# Altium project LED_Board.PrjPcb
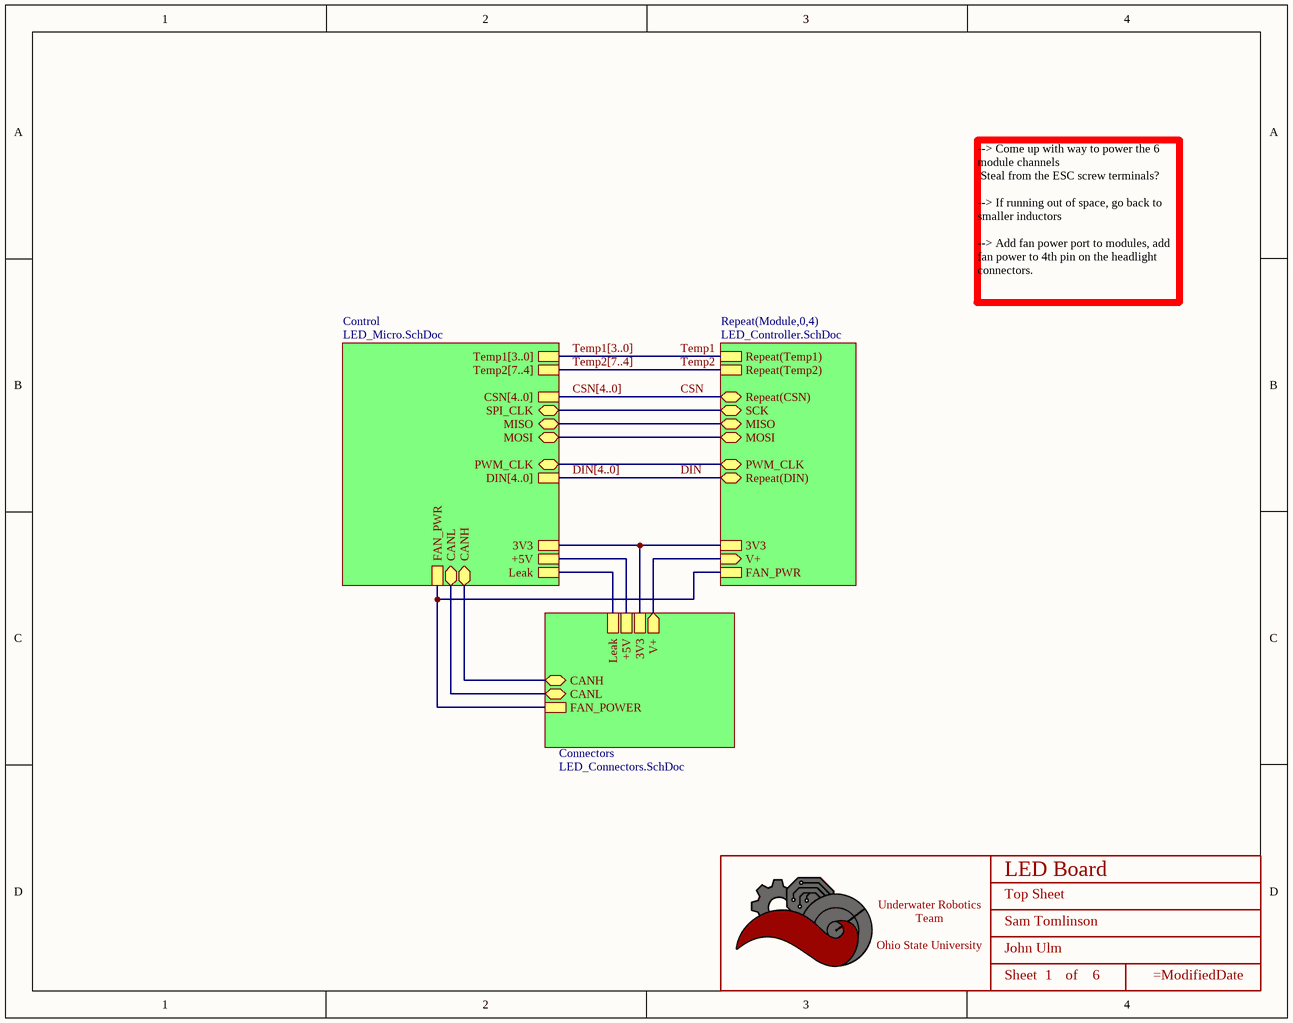
[diagram p0: LED_Board_Top.SchDoc]
BoardRevision: 1.0; DateOfDesignReview: XX/XX/XXXX; ProjectTitle: Sample Template Project; TeamLead: Sample Team Lead
4 sheets, 160 parts. Net scope: hierarchical (ports join the sheet entries above them; power ports are global).
Board file: LED_Control.PcbDoc
Sheets:
  LED_Board_Top.SchDoc
    Connectors = LED_Connectors.SchDoc
    Control = LED_Micro.SchDoc
    Module0 = LED_Controller.SchDoc
    Module1 = LED_Controller.SchDoc
    Module2 = LED_Controller.SchDoc
    Module3 = LED_Controller.SchDoc
    Module4 = LED_Controller.SchDoc

## Sheet LED_Board_Top.SchDoc: Top Sheet
size A; Author: Sam Tomlinson; SheetNumber: 1; SheetTotal: 6; TeamLead: John Ulm; ProjectTitle: LED Board

### Parts
(Parts that share a designator on the sheet are numbered #1, #2 ... from top to bottom, then left to right.)
*#1  Title_Block  [LOGO]  (value not drawn)  (graphical)

### Sub-sheets
Connectors = LED_Connectors.SchDoc: Leak, +5V, 3V3, CANH (bidir), CANL (bidir), FAN_POWER, V+ (out)
Control = LED_Micro.SchDoc: +5V, 3V3, PWM_CLK (bidir), SPI_CLK (bidir), MISO (bidir), MOSI (bidir), CANH (bidir), CANL (bidir), FAN_PWR, DIN[4..0], CSN[4..0], Temp1[3..0], Leak, Temp2[7..4]
Repeat(Module,0,4) = LED_Controller.SchDoc: Repeat(CSN) (bidir), PWM_CLK (bidir), SCK (bidir), MOSI (bidir), MISO (bidir), Repeat(DIN) (bidir), V+ (in), Repeat(Temp1), 3V3, Repeat(Temp2), FAN_PWR

### Nets
_+5V: sheet Connectors/+5V, sheet Control/+5V
_V+: sheet Connectors/V+, sheet Repeat(Module,0,4)/V+
_3V3: sheet Connectors/3V3, sheet Control/3V3, sheet Repeat(Module,0,4)/3V3
_CANH: sheet Connectors/CANH, sheet Control/CANH
_CANL: sheet Connectors/CANL, sheet Control/CANL
_Fan_PWR: sheet Connectors/FAN_POWER, sheet Control/FAN_PWR, sheet Repeat(Module,0,4)/FAN_PWR
_Leak: sheet Connectors/Leak, sheet Control/Leak
_MISO: sheet Control/MISO, sheet Repeat(Module,0,4)/MISO
_MOSI: sheet Control/MOSI, sheet Repeat(Module,0,4)/MOSI
_PWM_CLK: sheet Control/PWM_CLK, sheet Repeat(Module,0,4)/PWM_CLK
_SCK: sheet Control/SPI_CLK, sheet Repeat(Module,0,4)/SCK
CSN: sheet Repeat(Module,0,4)/Repeat(CSN)
DIN: sheet Repeat(Module,0,4)/Repeat(DIN)
Temp1: sheet Repeat(Module,0,4)/Repeat(Temp1)
Temp2: sheet Repeat(Module,0,4)/Repeat(Temp2)

### Buses and harness runs
bus CSN[4..0] = sheet Control/CSN[4..0]
bus DIN[4..0] = sheet Control/DIN[4..0]
bus Temp1[3..0] = sheet Control/Temp1[3..0]
bus Temp2[7..4] = sheet Control/Temp2[7..4]

### Notes on the sheet
- --> Come up with way to power the 6 module channels
  Steal from the ESC screw terminals?
  --> If running out of space, go back to smaller inductors
  --> Add fan power port to modules, add fan power to 4th pin on the headlight connectors.
- (in symbol Title_Block) Underwater Robotics Team / Ohio State University; Sheet; of

### Library data of the parts
*#1 = Title_Block: UWRT Schematic Title Block Template / Created June 2021, Dylan Trainor

## Sheet LED_Connectors.SchDoc: Connectors
size A; Author: Sam Tomlinson; SheetNumber: 2; SheetTotal: 6; ProjectTitle: LED Board; TeamLead: John Ulm
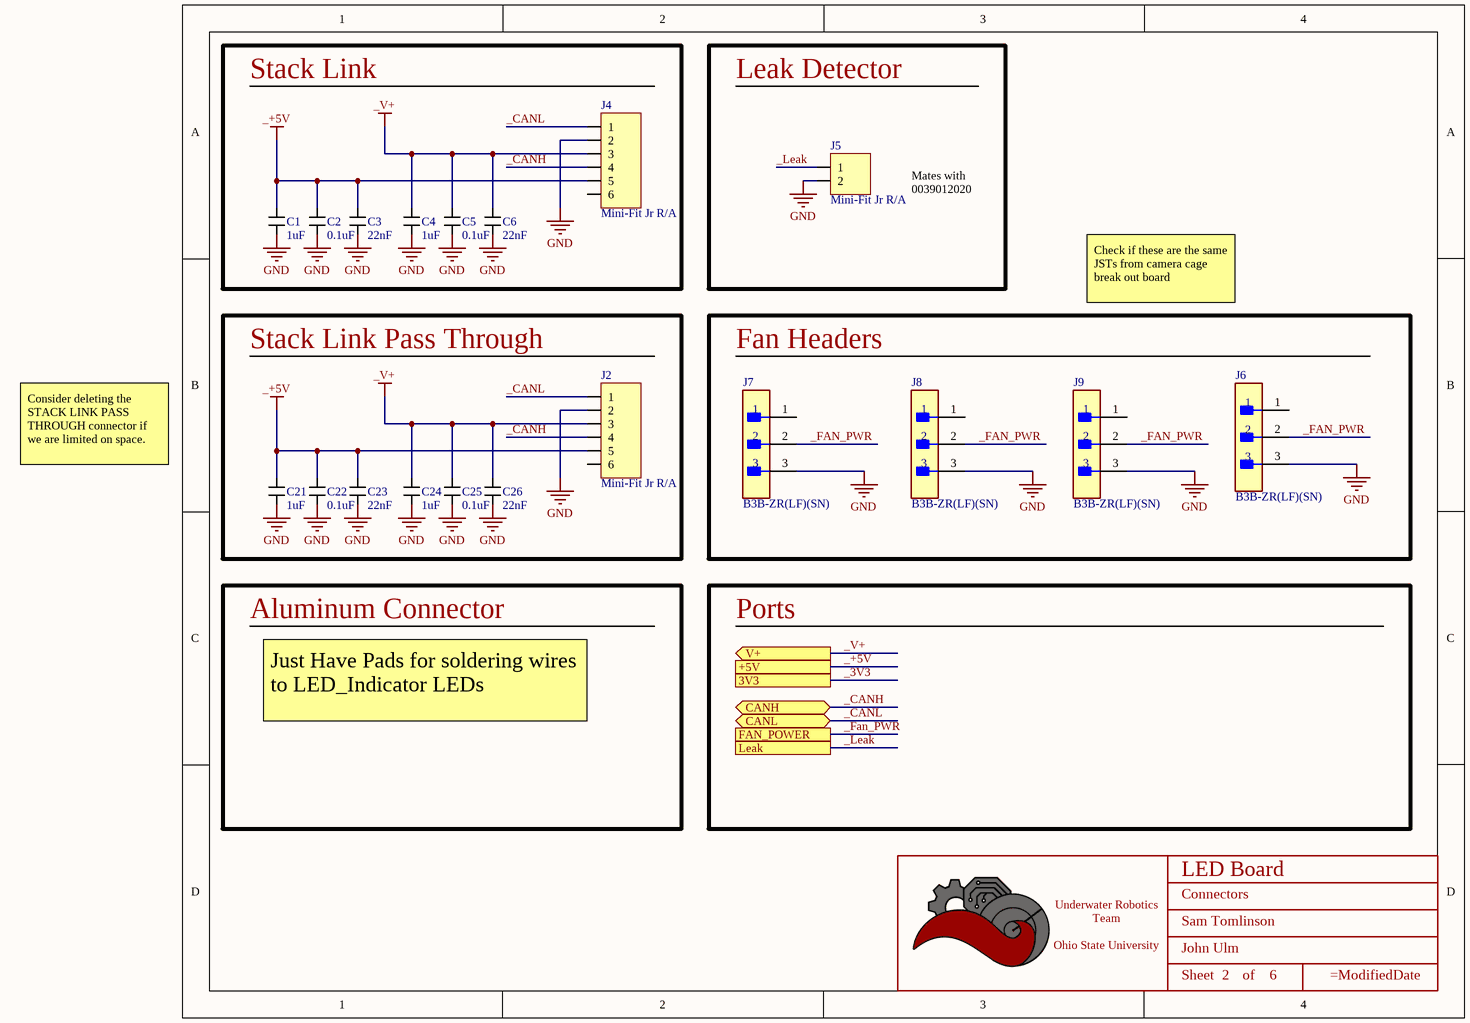
[diagram p1: LED_Connectors.SchDoc]

### Parts
(Parts that share a designator on the sheet are numbered #1, #2 ... from top to bottom, then left to right.)
*#2  Title_Block  [LOGO]  (value not drawn)  (graphical)
C1  value 1uF  [CAPACITOR_0603]  (hidden comment: 1uF Ceramic 16V)
C2  value 0.1uF  [CAPACITOR_0805]  (hidden comment: 100nF Ceramic 50V)
C3  value 22nF  [CAPACITOR_0402]  (hidden comment: 22nF Ceramic 25V)
C4  value 1uF  [CAPACITOR_0603]  (hidden comment: 1uF Ceramic 16V)
C5  value 0.1uF  [CAPACITOR_0805]  (hidden comment: 100nF Ceramic 50V)
C6  value 22nF  [CAPACITOR_0402]  (hidden comment: 22nF Ceramic 25V)
C21  value 1uF  [CAPACITOR_0603]  (hidden comment: 1uF Ceramic 16V)
C22  value 0.1uF  [CAPACITOR_0805]  (hidden comment: 100nF Ceramic 50V)
C23  value 22nF  [CAPACITOR_0402]  (hidden comment: 22nF Ceramic 25V)
C24  value 1uF  [CAPACITOR_0603]  (hidden comment: 1uF Ceramic 16V)
C25  value 0.1uF  [CAPACITOR_0805]  (hidden comment: 100nF Ceramic 50V)
C26  value 22nF  [CAPACITOR_0402]  (hidden comment: 22nF Ceramic 25V)
J2  Mini-Fit Jr R/A  [CONN_MOLEX_MINIFIT JR_6 POS_R/A]
J4  Mini-Fit Jr R/A  [CONN_MOLEX_MINIFIT JR_6 POS_R/A]
J5  Mini-Fit Jr R/A  [CONN_MOLEX_MINIFIT JR_2 POS_R/A]
J6  B3B-ZR(LF)(SN)  [FP-B3B-ZR_LF_SN-MFG]
J7  B3B-ZR(LF)(SN)  [FP-B3B-ZR_LF_SN-MFG]
J8  B3B-ZR(LF)(SN)  [FP-B3B-ZR_LF_SN-MFG]
J9  B3B-ZR(LF)(SN)  [FP-B3B-ZR_LF_SN-MFG]

### Blocks framed on the sheet
Stack Link: C1-C6 J4
Leak Detector: J5
Stack Link Pass Through: C21-C26 J2
Fan Headers: J6-J9

### Ports
3V3, +5V, CANH (bidir), CANL (bidir), FAN_POWER, Leak, V+ (out)

### Nets
_+5V: C1.1 C2.1 C3.1 C21.1 C22.1 C23.1 J2.5 J4.5 ; port +5V
_V+: C4.1 C5.1 C6.1 C24.1 C25.1 C26.1 J2.3 J4.3 ; port V+
GND: C1.2 C2.2 C3.2 C4.2 C5.2 C6.2 C21.2 C22.2 C23.2 C24.2 C25.2 C26.2 J2.2 J4.2 J5.2 J6.3 J7.3 J8.3 J9.3
_CANH: J2.4 J4.4 ; port CANH
_CANL: J2.1 J4.1 ; port CANL
_Fan_PWR: J6.2 J7.2 J8.2 J9.2 ; port FAN_POWER
_Leak: J5.1 ; port Leak

Not connected (* = marked no-connect by the designer): J2 6; J4 6; J6 1; J7 1; J8 1; J9 1

### Notes on the sheet
- Mates with
  0039012020
- Check if these are the same JSTs from camera cage break out board
- Consider deleting the STACK LINK PASS THROUGH connector if we are limited on space.
- Aluminum Connector
- Ports
- Just Have Pads for soldering wires to LED_Indicator LEDs
- (in symbol Title_Block) Underwater Robotics Team / Ohio State University; Sheet; of

### Library data of the parts
*#2 = Title_Block: as *#1 on sheet LED_Board_Top
C1 C4 C21 C24 = CAPACITOR_1uF_0603: Cap 1uF 16V +/-10% / Ceramic 0603; Made By: Flip B; Tolerance: +/- 10%; Voltage: 16V; Supplier 1: Digi-Key; Supplier Part Number 1: 399-7847-1-ND
C2 C5 C22 C25 = CAPACITOR_0.1uF_0805: Cap 100nF 50V +/-10% / Ceramic 0805; Made By: Robert Pafford; Tolerance: +/- 10%; Voltage: 50V; Supplier 1: Newark; Supplier Part Number 1: 38AH3645
C3 C6 C23 C26 = CAPACITOR_0.022uF_0402: Cap 22nF 25V +/-10% / Ceramic 0402; Made By: Robert Pafford; Tolerance: +/- 10%; Voltage: 25V; Supplier 1: Digi-Key; Supplier Part Number 1: 445-1261-1-ND
J2 J4 = CONN_MOLEX_MINIFIT JR_6POS_R/A: Molex Minifit Jr. 5569 / 6 Pos R/A Natural; Pitch: 4.2mm; Configuration: Right Angle; Current Per Pin: 13A; Number of Positions: 8; Manufacturer: Molex; Color: Natural; Created By: Flip B; ComponentLink1Description: Datasheet; ComponentLink1URL: https://www.molex.com/pdm_docs/ps/PS-5556-001.pdf; Series: Minifit Jr 5569; Supplier 1: Digi-Key; Supplier Part Number 1: WM1353-ND
J5 = CONN_MOLEX_MINIFIT JR_2POS_R/A: Molex Minifit Jr. 5569 / 2 Pos R/A Natural; Pitch: 4.2mm; Configuration: Right Angle; Current Per Pin: 13A; Number of Positions: 2; Manufacturer: Molex; Color: Natural; Created By: Robert P; ComponentLink1Description: Datasheet; ComponentLink1URL: https://www.molex.com/pdm_docs/sd/026013115_sd.pdf; Series: Minifit Jr 5569; Supplier 1: Digi-Key; Supplier Part Number 1: WM1351-ND
J6-J9 = CMP-17439-000041-1: CONN HEADER VERT 3POS 1.5MM; Gender: Male; Max Voltage Rating (AC): 50V; Body Plating: Tin; Panel Thickness: 3.5mm; Number of Contacts: 3; Connector Type: Male Pin; Max Current Rating: 1A; Insulation Resistance: 500MR; Contact Resistance: 30mR; Pitch: 1.5mm; Lead Pitch: 1.5mm; Termination: Solder; Material: Nylon; Depth: 3.5mm; Min Operating Temperature: -25°C; Voltage Rating (DC): 50V; Number of Positions: 3; Voltage Rating (AC): 50V; Contact Plating: Tin; Housing Material: Polyamide; Mount: Through Hole; Number of Rows: 1; Series: ZH; Lead Free: Lead Free; Flammability Rating: UL94 V-0; Housing Color: Beige; REACH SVHC: No SVHC; Current Rating: 1A; Contact Type: Male Pin; Orientation: Straight; Voltage Rating: 50V; Packaging: Bulk; Color: Natural; Length: 6mm; Contact Material: Copper; Max Operating Temperature: 85°C; Fastening Type: Detent; Contact Mating Length: 0.094inch

## Sheet LED_Micro.SchDoc: LED Board Control
size B; Author: Sam Tomlinson; Organization: ORGANIZATION; Address1: ADDRESS 1; Address2: ADDRESS 2; Address3: ADDRESS 3; Address4: ADDRESS 4; Revision: -; SheetNumber: 4; SheetTotal: 6; ENG_APP_DATE: --/--/--; DSN_APP_DATE: --/--/--; CHK_APP_DATE: --/--/--; TeamLead: John Ulm; ProjectTitle: Led Board
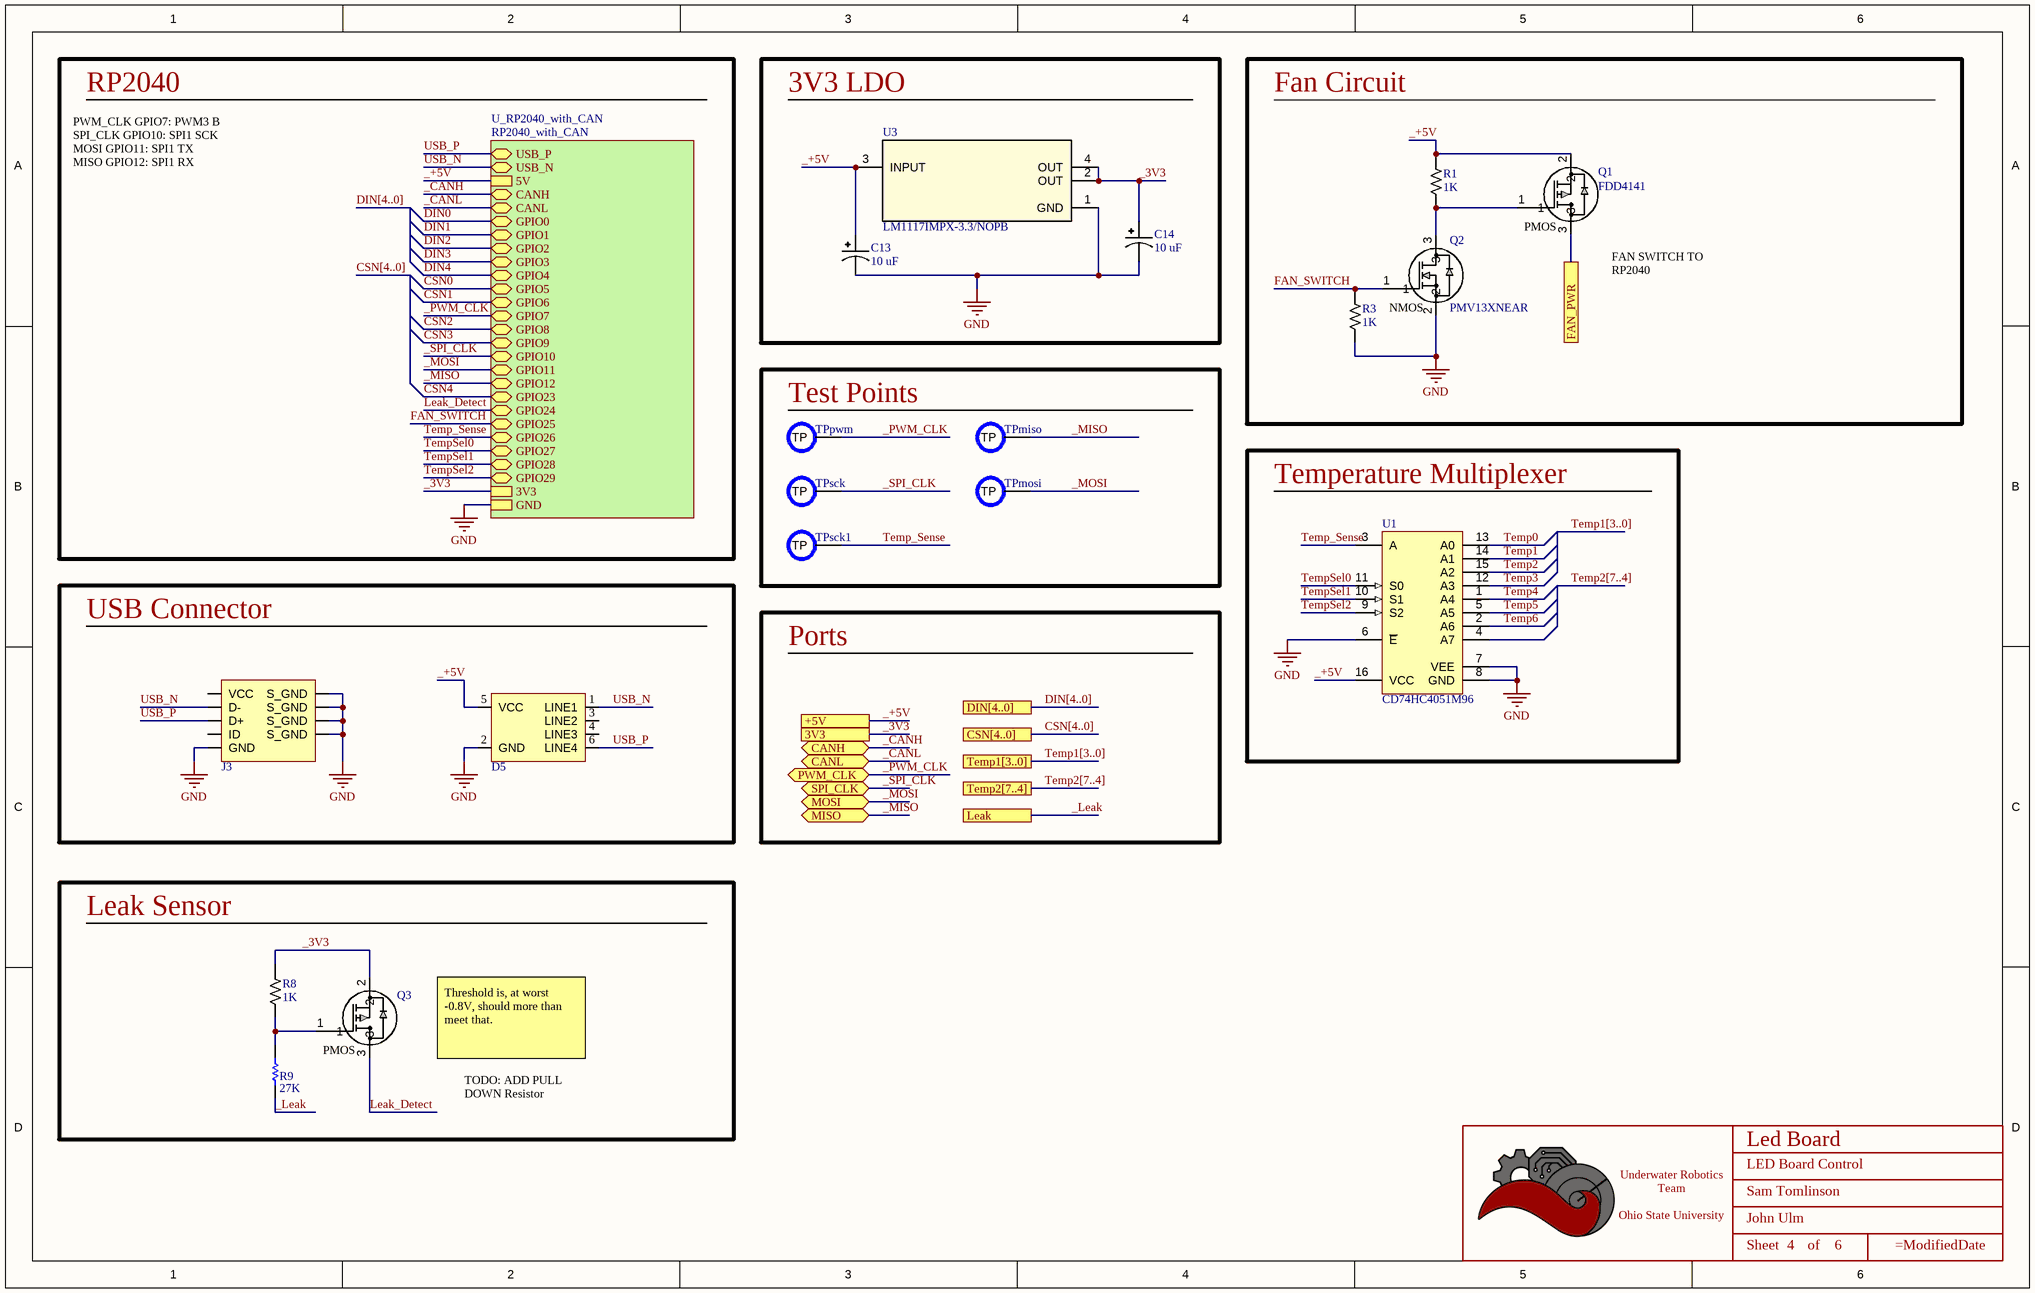
[diagram p2: LED_Micro.SchDoc]

### Parts
(Parts that share a designator on the sheet are numbered #1, #2 ... from top to bottom, then left to right.)
*#3  Title_Block  [LOGO]  (value not drawn)  (graphical)
C13  Value (uF): 10 uF  [CAPACITOR_1206 - POLAR]  (hidden comment: 10uF Tantalum 16V)
C14  Value (uF): 10 uF  [CAPACITOR_1206 - POLAR]  (hidden comment: 10uF Tantalum 16V)
D5  TVS DIODE 5VWM 25VC SOT23-6  [SOT 23-6L]  (value not drawn)
J3  USB_MICRO R/A  [CONN_MINIUSB]  (value not drawn)
Q1  FDD4141  [DPAK_ONS]
Q2  PMV13XNEAR  [SOT-23-3]
Q3  MOSFET P-CHANNEL 20V 4.7A SOT23  [SOT-23-3]  (value not drawn)
R1  Value  (Ohms): 1K  [RESISTOR_0603]  (hidden comment: 1k Ohm 5% 1/8W)
R3  Value  (Ohms): 1K  [RESISTOR_0603]  (hidden comment: 1k Ohm 5% 1/8W)
R8  Value  (Ohms): 1K  [RESISTOR_0402]  (hidden comment: 1k Ohm 1% 1/16W)
R9  27K  [RESC1005X40X25ML05T05]
TPmiso  PCB Test Point  [TESTPOINT_1.2MM]  (value not drawn)  (no BOM)
TPmosi  PCB Test Point  [TESTPOINT_1.2MM]  (value not drawn)  (no BOM)
TPpwm  PCB Test Point  [TESTPOINT_1.2MM]  (value not drawn)  (no BOM)
TPsck  PCB Test Point  [TESTPOINT_1.2MM]  (value not drawn)  (no BOM)
TPsck1  PCB Test Point  [TESTPOINT_1.2MM]  (value not drawn)  (no BOM)
U1  CD74HC4051M96  [D0016A_M]
U3  LM1117IMPX-3.3/NOPB  [SOT-223-4]

### Blocks framed on the sheet
3V3 LDO: C13 C14 U3
Fan Circuit: Q1 Q2 R1 R3
Test Points: TPmiso TPmosi TPpwm TPsck TPsck1
Temperature Multiplexer: U1
USB Connector: D5 J3
Leak Sensor: Q3 R8 R9

### Sub-sheets
U_RP2040_with_CAN = RP2040_with_CAN (file not in this document): USB_P (bidir), USB_N (bidir), 5V, CANH (bidir), CANL (bidir), GPIO0 (bidir), GPIO1 (bidir), GPIO2 (bidir), GPIO3 (bidir), GPIO4 (bidir), GPIO5 (bidir), GPIO6 (bidir), GPIO7 (bidir), GPIO8 (bidir), GPIO9 (bidir), GPIO10 (bidir), GPIO11 (bidir), GPIO12 (bidir), GPIO23 (bidir), GPIO24 (bidir), GPIO25 (bidir), GPIO26 (bidir), GPIO27 (bidir), GPIO28 (bidir), GPIO29 (bidir), 3V3, GND

### Ports
3V3, +5V, CANH (bidir), CANL (bidir), CSN[4..0], DIN[4..0], FAN_PWR, Leak, MISO (bidir), MOSI (bidir), PWM_CLK (bidir), SPI_CLK (bidir), Temp1[3..0], Temp2[7..4]

### Nets
_+5V: C13.1 D5.5(VCC) Q1.2 R1.1 U1.16(VCC) U3.3(INPUT) ; port +5V, sheet U_RP2040_with_CAN/5V
GND: C13.2 C14.2 D5.2(GND) J3.5(GND) J3.6(S_GND) J3.7(S_GND) J3.8(S_GND) J3.9(S_GND) Q2.2 R3.2 U1.6(~{E}) U1.7(VEE) U1.8(GND) U3.1(GND) ; sheet U_RP2040_with_CAN/GND
_3V3: C14.1 Q3.2 R8.1 U3.2(OUT) U3.4(OUT) ; port 3V3, sheet U_RP2040_with_CAN/3V3
_CANH: port CANH, sheet U_RP2040_with_CAN/CANH
_CANL: port CANL, sheet U_RP2040_with_CAN/CANL
_Fan_PWR: Q1.3 ; port FAN_PWR
_Leak: R9.1 ; port Leak
_MISO: TPmiso.TP ; port MISO, sheet U_RP2040_with_CAN/GPIO12
_MOSI: TPmosi.TP ; port MOSI, sheet U_RP2040_with_CAN/GPIO11
_PWM_CLK: TPpwm.TP ; port PWM_CLK, sheet U_RP2040_with_CAN/GPIO7
_SPI_CLK: TPsck.TP ; port SPI_CLK, sheet U_RP2040_with_CAN/GPIO10  [project net _SCK]
FAN_SWITCH: Q2.1 R3.1 ; sheet U_RP2040_with_CAN/GPIO25
Leak_Detect: Q3.3 ; sheet U_RP2040_with_CAN/GPIO24
Temp0: U1.13(A0)
Temp1: U1.14(A1)
Temp2: U1.15(A2)
Temp3: U1.12(A3)
Temp4: U1.1(A4)
Temp5: U1.5(A5)
Temp6: U1.2(A6)
Temp_Sense: TPsck1.TP U1.3(A) ; sheet U_RP2040_with_CAN/GPIO26
TempSel0: U1.11(S0) ; sheet U_RP2040_with_CAN/GPIO27
TempSel1: U1.10(S1) ; sheet U_RP2040_with_CAN/GPIO28
TempSel2: U1.9(S2) ; sheet U_RP2040_with_CAN/GPIO29
USB_N: D5.1(LINE1) J3.2(D-) ; sheet U_RP2040_with_CAN/USB_N
USB_P: D5.6(LINE4) J3.3(D+) ; sheet U_RP2040_with_CAN/USB_P
NetQ1_1: Q1.1 Q2.3 R1.2
NetQ3_1: Q3.1 R8.2 R9.2

Not connected (* = marked no-connect by the designer): D5 3(LINE2) 4(LINE3); J3 1(VCC) 4(ID); U1 4(A7)

### Buses and harness runs
bus CSN[4..0]
bus CSN[4..0] = port CSN[4..0]
bus DIN[4..0]
bus DIN[4..0] = port DIN[4..0]
bus Temp1[3..0]
bus Temp1[3..0] = port Temp1[3..0]
bus Temp2[7..4]
bus Temp2[7..4] = port Temp2[7..4]

### Notes on the sheet
- RP2040
- PWM_CLK GPIO7: PWM3 B
  SPI_CLK GPIO10: SPI1 SCK
  MOSI GPIO11: SPI1 TX
  MISO GPIO12: SPI1 RX
- (near Q1) FAN SWITCH TO RP2040
- Ports
- Threshold is, at worst -0.8V, should more than meet that.
- TODO: ADD PULL DOWN Resistor
- DWG. NO.
- REV.
- SHT.
- THIS DOCUMENT AND THE DATA DISCLOSED HEREIN OR HEREWITH IS THE PROPERTY OF ALTIUM LIMITED AND MAY BE FREELY DISTRIBUTED IN WHOLE. NO RIGHTS ARE RESERVED OR EXPRESS OR IMPLIED WARANTEE GIVEN.
- REVISION
- DESCRIPTION
- DATE
- APPROVED
- ENG:
- APPROVALS
- PROJECT
- DSN:
- CHK:
- REFERENCE DOCUMENTS
- PROJECT REVISION:
- TITLE
- DOCUMENT REVISION:
- DESIGN ITEM:
- BOM:
- FAB DWG:
- PCB DWG:
- ASSY DWG:
- SCALE:
- SIZE
- B
- CAGE CODE
- FILE NAME
- DWG NO.
- SHEET
- OF
- REV
- (in symbol FDD4141) PMOS
- (in symbol PMV13XNEAR) NMOS
- (in symbol Title_Block) Underwater Robotics Team / Ohio State University; Sheet; of
- (in symbol TSM500P02CX) PMOS

### Library data of the parts
*#3 = Title_Block: as *#1 on sheet LED_Board_Top
C13 C14 = CAPACITOR_10uF_1206_Tantalum_1: Cap 10uF 16V +/-20% / Tantalum 1206; Tolerance: +/- 10%; Made By: Dylan T; ComponentLink1Description: Digikey; ComponentLink1URL: https://www.digikey.com/en/products/detail/kyocera-avx/F981A106MMA/4004990; Voltage: 16V; Supplier 1: Newark; Supplier Part Number 1: 26AC4143
D5 = RCLAMP0504S.TCT: 25V Clamp 6A (8/20µs) Ipp Tvs Diode Surface Mount SOT-23-6; Made By: Robert Pafford; Reverse Standoff Voltage (Typ): 5V; Breakdown Voltage (Min): 6V; Supplier 1: Digi-Key; Supplier Part Number 1: RCLAMP0504SCT-ND; Clamping Voltage (Max): 25V
J3 = CONN_MICROUSB: Amphenol Micro USB-B / USB2.0 5 Pin Right Angle SMD; Pitch: 0.65mm; Current Per Pin: 1.8A; Number of Positions: 5; Manufacturer: Amphenol; Configuration: Right Angle; Color: Silver; Created By: Flip B; ComponentLink1Description: Datasheet; ComponentLink1URL: https://cdn.amphenol-icc.com/media/wysiwyg/files/documentation/datasheet/inputoutput/io_usb_micro.pdf?__cf_chl_jschl_tk__=05693735e19256298f6ef6ca2bb2e65c376a4f56-1625503833-0-Abitsb0-ufjOXJYs_S3J3r2iTn-nObalbmXUksF1VvO_h_WEmRdMlUD1I8-hmWSEVWzY1pirKnrPZWfgY3851qyBZe5ZvnNQePLGIzUgdEIQBVUyW36RsbYpDLEWxJ4horD-5gChFgobLYqwmG5aHl0E8lIn_twwPPrOxilK2gP0q9t_CNOs_u5fMqXvXUrlsOv8tIE2NRlu6NVP8qtkL2GjhlkeTUbDMF8WvvpPDTFOgvZ4Y16Ej8F8AhWos88mo5B1HssXozw0XrkJQIqERITUu6rqloz9kf4ZzhBHtDAt-IkiAFY_Ds9SW8FYKKTtINJVpHZQ6Gyu1FFM4Dc9MO0maE8_mmNcwlxqyRoRk_MPWW8VyByXWM5RSp52jteRKw7FeI9WIYvCbPAOy0Eyib-aseIQsnGbglBcUY6_2xp8GYaJM38H3dNvBPsSOfJBPndKedwKHllxjkucXn6xsN0sDXkpGN-cu8_2bDTJ0g-uUucKSCooYX-ApSDNGpkA_p9zv1SOAD8c0zaZVmtiBsN75QpVz2rzq9_BFxOywPvR; Series: 10118192; Supplier 1: Digi-Key; Supplier Part Number 1: 609-4613-1-ND
Q1 = FDD4141: P-Channel 10.8A (Ta), 50A (Tc) 2.4W (Ta), 69W (Tc) Surface Mount D-PAK (TO-252AA); FET Type: P-Channel, Power; Vendor: ON Semiconductor; SourceLibrary: ON_Semiconductor_2020-01-13; Vgs (Max): ±20V; Vgs (th): 3V @ 250µA; Vdss: 40 V; Rds (on): 12.3mOhm @ 12.7A, 10V; Amp Rating: 10.8 A; Package: D-PAK (TO-252AA); Manufacturer_Part_Number: FDD4141; Power Dissipation: 2.4W (Ta), 69W (Tc); Supplier 1: Digi-Key; Supplier Part Number 1: FDD4141CT-ND; Created By: Dylan T
Q2 = PMV13XNEAR: N-Channel 20 V 7.3A (Ta) 610mW (Ta), 8.3W (Tc) Surface Mount TO-236AB; Vendor: Nexperia USA Inc.; SourceLibrary: ON_Semiconductor_2020-01-13; Vgs (Max): +/- 12 V; Vgs (th): 1.3V @ 250uA; Vdss: 20 V; Rds (on): 15mOhm @ 7.3A, 8V; Amp Rating: 7.3 A; FET Type: N-Channel; Package: SOT23-3L; Manufacturer _Part_Number: PMV13XNEAR; Power Dissipation: 610mW (Ta), 8.3W (Tc); Created By: Dylan T; Supplier 1: Mouser; Supplier Part Number 1: 771-PMV13XNEAR
Q3 = TSM500P02CX: P-Channel 20 V 4.7A (Tc) 1.56W (Tc) Surface Mount SOT-23; Vendor: Taiwan Semiconductor Corporation; Vgs (Max): ±10V; Vgs (th): 800mV @ 250µA; Rds (on): 50mOhm @ 3A, 4.5V; Amp Rating: 4.7 A; FET Type: P-Channel; Package: TO-236-3, SC-59, SOT-23-3; Manufacturer_Part_Number: TSM500P02CX; Vdss: 20 V; Power Dissipation: 1.56W (Tc); Created By: Robert Pafford; Supplier 1: Digi-Key; Supplier Part Number 1: TSM500P02CXRFGCT-ND
R1 R3 = RESISTOR_1K_0603: RES 1k OHM 5% 1/8W 0603; Tolerance: +/- 5%; Made By: Robert Pafford; ComponentLink1Description: Datasheet; ComponentLink1URL: https://www.bourns.com/docs/product-datasheets/CRxxxxx.pdf; Wattage: 1/8W; Supplier: Digikey; Digikey Part Numer: CR0603-JW-104ELFTR-ND; Supplier 1: Digi-Key; Supplier Part Number 1: 2019-RK73B1JTTD102JCT-ND
R8 = RESISTOR_1K_0402: RES 1k OHM 1% 1/16W 0402; Tolerance: +/- 1%; Made By: Robert Pafford; Wattage: 1/16W; Supplier: Digikey; Digikey Part Numer: CR0603-JW-104ELFTR-ND; Supplier 1: Digi-Key; Supplier Part Number 1: 13-AC0402FR-131KLCT-ND
R9 = CMP-2002-00501-1: RES SMD 27K OHM 5% 1/10W 0402ERJ-2GEJ273X; Manufacturer: Panasonic; Part Number: ERJ-2GEJ273X
TPmiso TPmosi TPpwm TPsck TPsck1 = TESTPOINT: Made By: Robert Pafford
U1 = CMP-1575-00036-4: High Speed CMOS 8-Channel Analog Multiplexer/Demultiplexer, D0016A, LARGE T&R; Manufacturer: Texas Instruments; Crosstalk: Yes; Ron(Max)(Ohms): 130; VCC(Min)(V): 2; Bandwidth(Max)(MHz): 180; VCC(Max)(V): 6; Rating: Catalog; Configuration: 1 X 1：8 MUX; Ron(Typ)(Ohms): 45; Generic Part Number: CD74HC4051; Output Type: CMOS; Operating Temperature Range(C): -55 to 125; DatasheetVersion: SCHS122J; Code_JEDEC: MS-012 variation AC; PackageReference: D0016A; PackageVersion: http://www.ti.com/lit/ml/mpds178g/mpds178g.pdf
U3 = LM1117IMPX-3.3/NOPB: IC REG LIN 3.3V 800MA SOT223-4; PartNumber: LM1117IMP-3.3/NOPB; Manufacturer: Texas Instruments; Vin (Max): 15V; Supplier 1: Digi-Key; Supplier Part Number 1: LM1117IMPX-3.3/NOPBCT-ND; Vout (Min/Fixed): 3.3V; Amp Out: 800mA; Package: SOT-223-4; Created By: Dylan T

## Sheet LED_Controller.SchDoc: LED Module
size A; Author: Sam Tomlinson; SheetNumber: 3; SheetTotal: 6; TeamLead: John Ulm; ProjectTitle: LED Board
Used 5 times, as channels Module0, Module1, Module2, Module3, Module4. Parts and nets are listed once, with the designators drawn on the sheet.
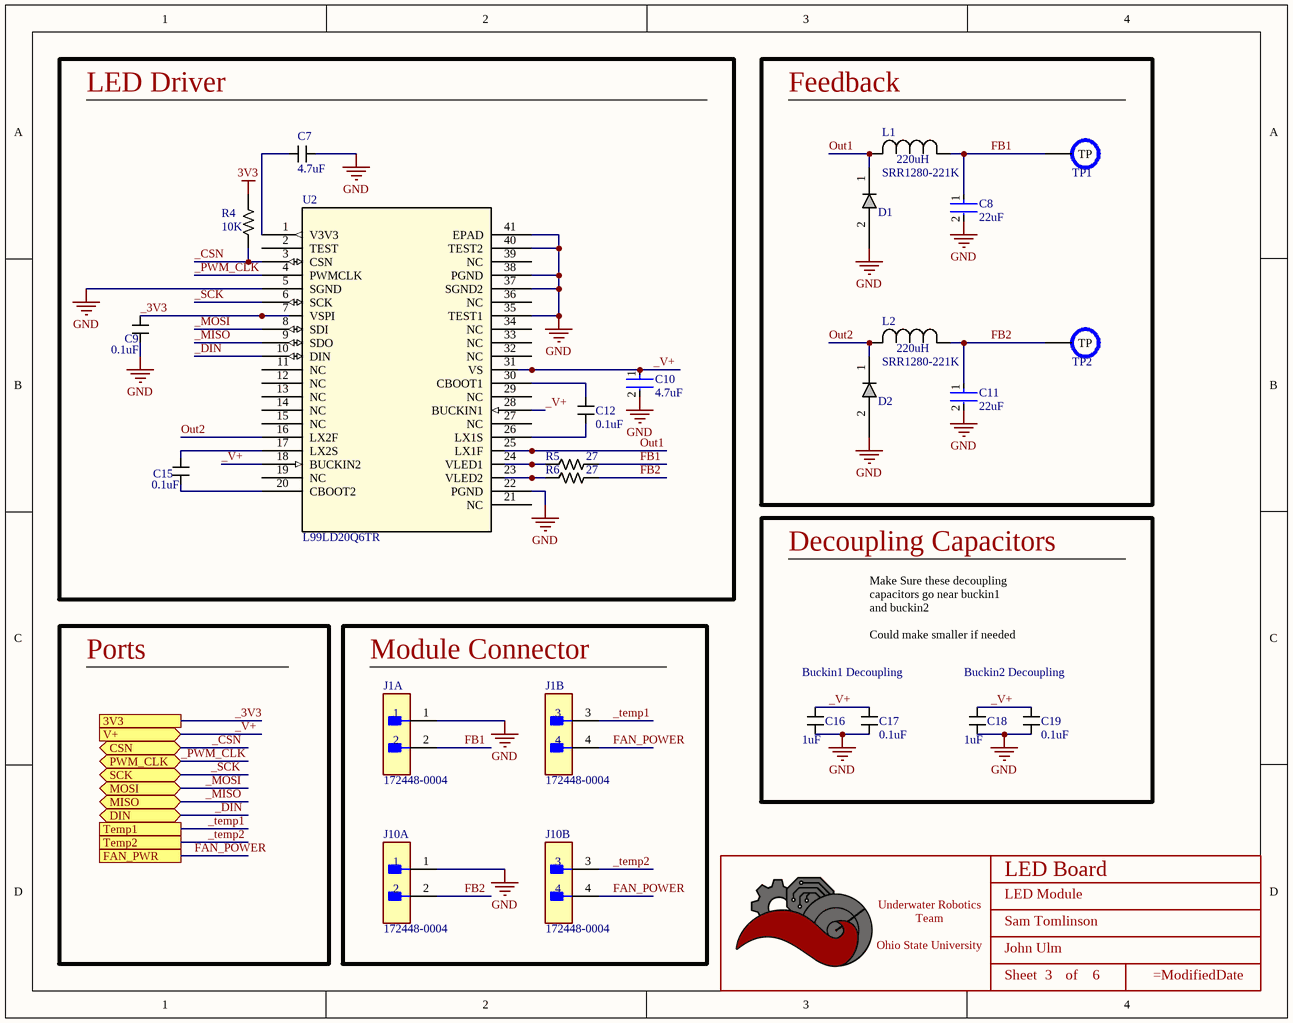
[diagram p3: LED_Controller.SchDoc]

### Parts
*  Title_Block  [LOGO]  (value not drawn)  (graphical)
C7  value 4.7uF  [CAPACITOR_0603]  (hidden comment: 4.7uF Ceramic 6.3V)
C8  22uF  [FP-C2012-125-0_2-MFG]
C9  value 0.1uF  [CAPACITOR_0603]  (hidden comment: 100nF Ceramic 6.3V)
C10  4.7uF  [CAPACITOR_0603]
C11  22uF  [FP-C2012-125-0_2-MFG]
C12  value 0.1uF  [CAPACITOR_0603]  (hidden comment: 100nF Ceramic 25V)
C15  value 0.1uF  [CAPACITOR_0603]  (hidden comment: 100nF Ceramic 25V)
C16  value 1uF  [CAPACITOR_0603]  (hidden comment: 1uF Ceramic 25V)
C17  value 0.1uF  [CAPACITOR_0603]  (hidden comment: 100nF Ceramic 25V)
C18  value 1uF  [CAPACITOR_0603]  (hidden comment: 1uF Ceramic 25V)
C19  value 0.1uF  [CAPACITOR_0603]  (hidden comment: 100nF Ceramic 25V)
D1  CCS15S40,L3F  [SOD-963   CST2C_TOS]  (value not drawn)
D2  CCS15S40,L3F  [SOD-963   CST2C_TOS]  (value not drawn)
J1  172448-0004  [FP-172448-0004-MFG]  (parts A,B of 2)
J10  172448-0004  [FP-172448-0004-MFG]  (parts A,B of 2)
L1  SRR1280-221K  [IND_BOURNS_SRR1280]
L2  SRR1280-221K  [IND_BOURNS_SRR1280]
R4  Value  (Ohms): 10K  [RESISTOR_0402]  (hidden comment: 10k Ohm 1% 1/16W)
R5  Value  (Ohms): 27  [RESISTOR_0603]  (hidden comment: 27 Ohm 5% 1/8W)
R6  Value  (Ohms): 27  [RESISTOR_0603]  (hidden comment: 27 Ohm 5% 1/8W)
TP1  PCB Test Point  [TESTPOINT_1.2MM]  (value not drawn)  (no BOM)
TP2  PCB Test Point  [TESTPOINT_1.2MM]  (value not drawn)  (no BOM)
U2  L99LD20Q6TR  [L99LD20Q6TR]

### Blocks framed on the sheet
LED Driver: C7 C9 C10 C12 C15 R4-R6 U2
Feedback: C8 C11 D1 D2 L1 L2 TP1 TP2
Decoupling Capacitors: C16-C19
Module Connector: J1 J10

### Ports
3V3, CSN (bidir), DIN (bidir), FAN_PWR, MISO (bidir), MOSI (bidir), PWM_CLK (bidir), SCK (bidir), Temp1, Temp2, V+ (in)

### Nets
3V3: R4.1
GND: C7.1 C8.2 C9.2 C10.2 C11.2 C16.1 C17.2 C18.1 C19.2 D1.2 D2.2 J1.1 J10.1 U2.5(SGND) U2.22(PGND) U2.35(TEST1) U2.37(SGND2) U2.38(PGND) U2.40(TEST2) U2.41(EPAD)
_3V3: C9.1 U2.7(VSPI) ; port 3V3
_CSN: R4.2 U2.3(CSN) ; port CSN
_DIN: U2.10(DIN) ; port DIN
_MISO: U2.9(SDO) ; port MISO
_MOSI: U2.8(SDI) ; port MOSI
_PWM_CLK: U2.4(PWMCLK) ; port PWM_CLK
_SCK: U2.6(SCK) ; port SCK
_temp1: J1.3 ; port Temp1
_temp2: J10.3 ; port Temp2
_V+: C10.1 C16.2 C17.1 C18.2 C19.1 U2.18(BUCKIN2) U2.28(BUCKIN1) U2.31(VS) ; port V+
FAN_POWER: J1.4 J10.4 ; port FAN_PWR
FB1: C8.1 J1.2 L1.1 R5.1 TP1.TP
FB2: C11.1 J10.2 L2.1 R6.1 TP2.TP
Out1: D1.1 L1.2 U2.25(LX1F)
Out2: D2.1 L2.2 U2.16(LX2F)
NetC7_2: C7.2 U2.1(V3V3)
NetC12_1: C12.1 U2.30(CBOOT1)
NetC12_2: C12.2 U2.26(LX1S)
NetC15_1: C15.1 U2.17(LX2S)
NetC15_2: C15.2 U2.20(CBOOT2)
NetR5_2: R5.2 U2.24(VLED1)
NetR6_2: R6.2 U2.23(VLED2)

Not connected (* = marked no-connect by the designer): U2 2(TEST) 11(NC) 12(NC) 13(NC) 14(NC) 15(NC) 19(NC) 21(NC) 27(NC) 29(NC) 32(NC) 33(NC) 34(NC) 36(NC) 39(NC)

### Channels
Module0: designators end in _1; ports 3V3=_3V3 CSN=_CSN_Module0 DIN=_DIN_Module0 FAN_PWR=_Fan_PWR MISO=_MISO MOSI=_MOSI PWM_CLK=_PWM_CLK SCK=_SCK Temp1=_temp1_Module0 Temp2=_temp2_Module0 V+=_V+
Module1: designators end in _2; ports 3V3=_3V3 CSN=_CSN_Module1 DIN=_DIN_Module1 FAN_PWR=_Fan_PWR MISO=_MISO MOSI=_MOSI PWM_CLK=_PWM_CLK SCK=_SCK Temp1=_temp1_Module1 Temp2=_temp2_Module1 V+=_V+
Module2: designators end in _3; ports 3V3=_3V3 CSN=_CSN_Module2 DIN=_DIN_Module2 FAN_PWR=_Fan_PWR MISO=_MISO MOSI=_MOSI PWM_CLK=_PWM_CLK SCK=_SCK Temp1=_temp1_Module2 Temp2=_temp2_Module2 V+=_V+
Module3: designators end in _4; ports 3V3=_3V3 CSN=_CSN_Module3 DIN=_DIN_Module3 FAN_PWR=_Fan_PWR MISO=_MISO MOSI=_MOSI PWM_CLK=_PWM_CLK SCK=_SCK Temp1=_temp1_Module3 Temp2=_temp2_Module3 V+=_V+
Module4: designators end in _5; ports 3V3=_3V3 CSN=_CSN_Module4 DIN=_DIN_Module4 FAN_PWR=_Fan_PWR MISO=_MISO MOSI=_MOSI PWM_CLK=_PWM_CLK SCK=_SCK Temp1=_temp1_Module4 Temp2=_temp2_Module4 V+=_V+

### Notes on the sheet
- Ports
- Buckin1 Decoupling
- Make Sure these decoupling capacitors go near buckin1 and buckin2
  Could make smaller if needed
- Buckin2 Decoupling
- (in symbol INDUCTOR_SRR1280-221K) 220uH
- (in symbol Title_Block) Underwater Robotics Team / Ohio State University; Sheet; of

### Library data of the parts
* = Title_Block: as *#1 on sheet LED_Board_Top
C7 = CAPACITOR_4.7uF_0603: Cap 4.7uF 6.3V +/-10% / Ceramic 0603; Made By: Robert Pafford; Tolerance: +/- 10%; Voltage: 6.3V; Supplier 1: Digi-Key; Supplier Part Number 1: 1276-2087-1-ND
C8 C11 = CMP-2000-06038-3: Multilayer Ceramic Capacitors 22μF ±20% 35V X5R SMD 0805; Tolerance: 20%; RoHS Compliant: Yes; Height: 1.25mm; Termination: SMD/SMT; Case/Package: 0805; Thickness: 0.057inch; Max Operating Temperature: 85°C; Min Operating Temperature: -55°C; Voltage Rating (DC): 35V; Length: 0.079inch; Dielectric: X5R; Dielectric Material: Ceramic; Capacitance: 22uF; Voltage Rating: 35V; Mount: Surface Mount; Package Quantity: 2000; Lead Free: Lead Free; Weight: 0.000194oz; REACH SVHC: No SVHC; Width: 0.049inch; Packaging: Tape and Reel; Series: C; Case Code (Metric): 2012; Case Code (Imperial): 0805
C9 = CAPACITOR_0.1uF_0603_1: Cap 100nF 6.3V +/-10% / Ceramic 0603; Made By: Flip B; ComponentLink1Description: Datsheet; ComponentLink1URL: https://www.mouser.com/datasheet/2/212/KEM_C1002_X7R_SMD-1102033.pdf; Tolerance: +/- 10%; Voltage: 6.3V; Supplier 1: Digi-Key; Supplier Part Number 1: 399-15351-1-ND
C10 = CAP CERM 4.7UF 20% 35V: Chip Multilayer Ceramic Capacitors for General Purpose, 0603, 4.7uF, X5R, 15%, 20%, 35V; Voltage Rating (DC): 35V; Capacitance: 4.7uF; Dielectric: X5R; Case/Package: 0603; Min Operating Temperature: -55°C; Weight: 0.000222oz; Tolerance: 20%; Termination: SMD/SMT; Case Code (Imperial): 0603; Resistor Type: Ceramic; Thickness: 0.039inch; Case Code (Metric): 1608; Width: 0.8mm; Max Operating Temperature: 85°C; Mount: Surface Mount; Length: 0.063inch; Package Quantity: 4000; Height: 0.8mm; Voltage Rating: 35V; Packaging: Tape and Reel; Supplier 1: Arrow Electronics; Supplier Part Number 1: GRM188R6YA475ME15D
C12 C15 C17 C19 = CAPACITOR_0.1uF_0603_25V: Cap 100nF 25V +/-10% / Ceramic 0603; Voltage: 6.3V; Made By: Flip B; ComponentLink1Description: Datsheet; ComponentLink1URL: https://www.mouser.com/datasheet/2/212/KEM_C1002_X7R_SMD-1102033.pdf; Tolerance: +/- 10%; Supplier 1: Digikey; Supplier Part Number 1: 1276-1006-1-ND
C16 C18 = CAPACITOR_1uF_0603_25V: Cap 1uF 25V +/-10% / Ceramic 0603; Voltage: 16V; Made By: Flip B; Tolerance: +/- 10%; Supplier 1: Digikey; Supplier Part Number 1: 1276-1102-1-ND
D1 D2 = SCHOTTKY_40V_1.5A: DIODE SCHOTTKY 40V 1.5A CST2C; Mfr_Name: Toshiba Electronic Devices & Storage Corp.; Type: DEV; Copyright: Copyright (C) 2023 Ultra Librarian. All rights reserved.; Manufacturer_Part_Number: CCS15S40,L3F; RefDes: RefDes; Supplier 1: Digi-Key; Supplier Part Number 1: CCS15S40L3FCT-ND
J1 J10 = CMP-00257-52824861-1: 172448-0004 Conn Power HDR 4 POS 4.2mm Solder RA Thru-Hole 4 Terminal 1 Port Mini-Fit Jr™ Frame; Manufacturer Lifecycle Status: ACTIVE; Current Rating: 13A; Voltage Rating: 600V; Row Spacing: 4.191mm; Number of Positions: 4; Connector Type: Male Pin; Glow Wire Compliant: Compliant; Contact Material: Tin; Min Operating Temperature: -40°C; Number of Rows: 2; NexarPartId: 52824861; Height: 12.03mm; Max Operating Temperature: 105°C; Pitch: 4.191mm; Number of Contacts: 4; RoHS: Compliant; Lifecycle Status: Production; Fastening Type: Ramp; Orientation: Right Angle; Mount: Through Hole; Termination: Solder; Color: Black; Number of Circuits: 4; Country of Origin: US; Contact Plating: Tin
L1 L2 = INDUCTOR_SRR1280-221K: 220 µH Shielded Drum Core, Wirewound Inductor 1.6 A 400mOhm Max Nonstandard; Mfr_Name: Bourns Electronics; Type: DEV; Copyright: Copyright (C) 2023 Ultra Librarian. All rights reserved.; Manufacturer_Part_Number: SRR1280-221K; RefDes: RefDes; Supplier 1: Digi-Key; Supplier Part Number 1: SRR1280-221KLCT-ND
R4 = RESISTOR_10K_0402: RES 10k OHM 1% 1/16W 0402; Tolerance: +/- 1%; Made By: Robert Pafford; Wattage: 1/16W; Supplier: Digikey; Digikey Part Numer: CR0603-JW-104ELFTR-ND; Supplier 1: Digi-Key; Supplier Part Number 1: YAG3436CT-ND
R5 R6 = RESISTOR_27_0603: RES 27 OHM 5% 1/8W 0603; Tolerance: +/- 5%; Made By: Robert Pafford; ComponentLink1Description: Datasheet; ComponentLink1URL: https://www.bourns.com/docs/product-datasheets/CRxxxxx.pdf; Wattage: 1/8W; Supplier: Digikey; Digikey Part Numer: CR0603-JW-104ELFTR-ND; Supplier 1: Digi-Key; Supplier Part Number 1: 2019-RK73B1JTTD270JCT-ND
TP1 TP2 = TESTPOINT: Made By: Robert Pafford
U2 = L99LD20Q6TR: IC LED DRVR RGLTR PWM 1.5A 40QFN; Mfr_Name: STMicroelectronics; Copyright: Copyright (C) 2023 Ultra Librarian. All rights reserved.; Manufacturer_Part_Number: L99LD20Q6TR; RefDes: RefDes; Type: DEV; Supplier 1: Digi-Key; Supplier Part Number 1: 497-18126-1-ND

## Nets that join several sheets
3V3: Module0 (R4_1.1), Module1 (R4_2.1), Module2 (R4_3.1), Module3 (R4_4.1), Module4 (R4_5.1)
_+5V: LED_Connectors (8 pins), LED_Micro (6 pins)
_V+: LED_Connectors (8 pins), Module0 (8 pins), Module1 (8 pins), Module2 (8 pins), Module3 (8 pins), Module4 (8 pins)
GND: LED_Connectors (19 pins), LED_Micro (14 pins), Module0 (20 pins), Module1 (20 pins), Module2 (20 pins), Module3 (20 pins), Module4 (20 pins)
_3V3: LED_Micro (5 pins), Module0 (C9_1.1 U2_1.7), Module1 (C9_2.1 U2_2.7), Module2 (C9_3.1 U2_3.7), Module3 (C9_4.1 U2_4.7), Module4 (C9_5.1 U2_5.7)
_Fan_PWR: LED_Connectors (J6.2 J7.2 J8.2 J9.2), LED_Micro (Q1.3), Module0 (J1_1.4 J10_1.4), Module1 (J1_2.4 J10_2.4), Module2 (J1_3.4 J10_3.4), Module3 (J1_4.4 J10_4.4), Module4 (J1_5.4 J10_5.4)
_Leak: LED_Connectors (J5.1), LED_Micro (R9.1)
_MISO: LED_Micro (TPmiso.TP), Module0 (U2_1.9), Module1 (U2_2.9), Module2 (U2_3.9), Module3 (U2_4.9), Module4 (U2_5.9)
_MOSI: LED_Micro (TPmosi.TP), Module0 (U2_1.8), Module1 (U2_2.8), Module2 (U2_3.8), Module3 (U2_4.8), Module4 (U2_5.8)
_PWM_CLK: LED_Micro (TPpwm.TP), Module0 (U2_1.4), Module1 (U2_2.4), Module2 (U2_3.4), Module3 (U2_4.4), Module4 (U2_5.4)
_SCK: LED_Micro (TPsck.TP), Module0 (U2_1.6), Module1 (U2_2.6), Module2 (U2_3.6), Module3 (U2_4.6), Module4 (U2_5.6)